# EAGLE schematic working (EAGLE 9.6.2)
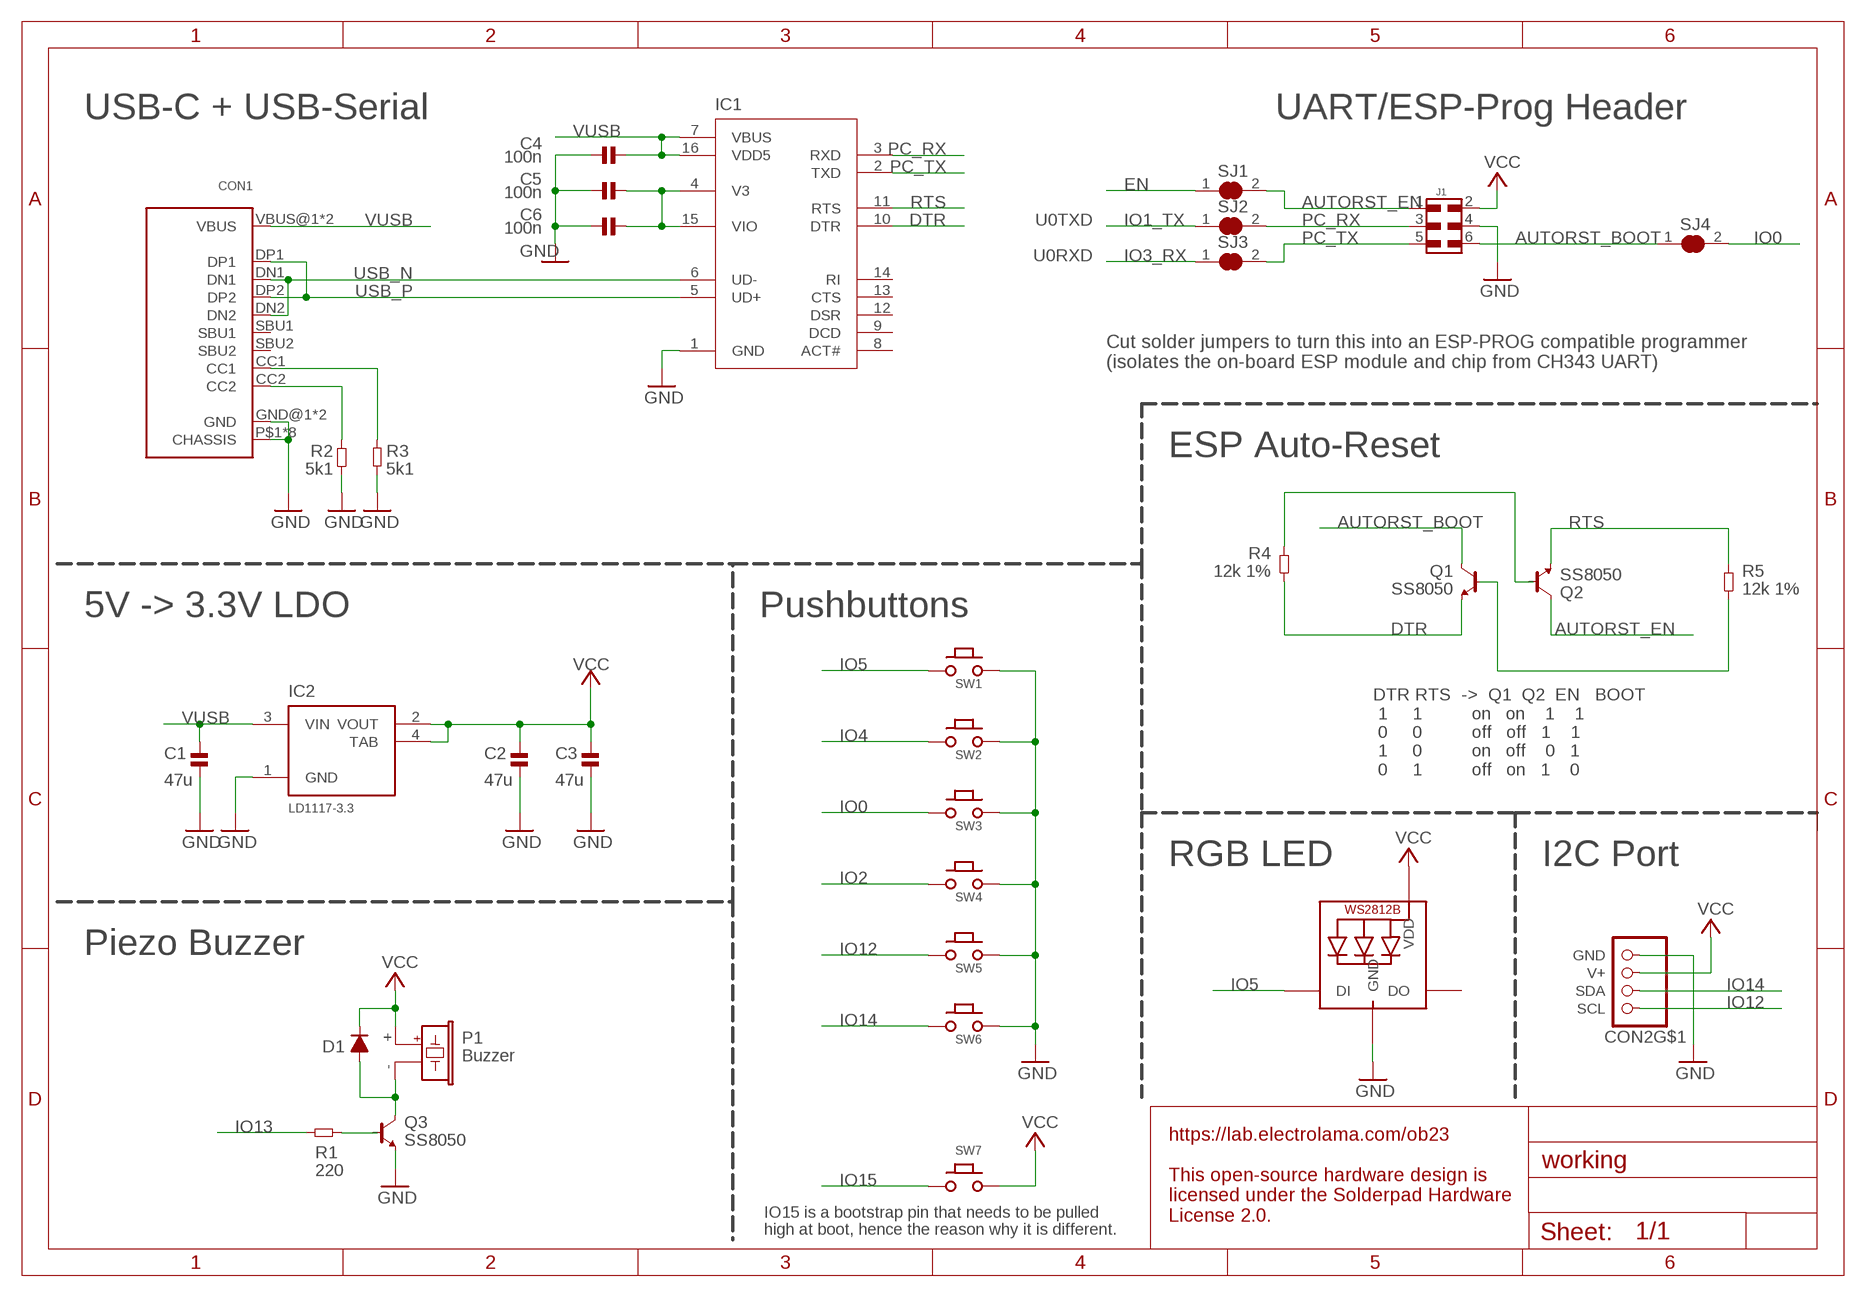
[diagram p0: schematic, sheet 1, part 1 of 2]
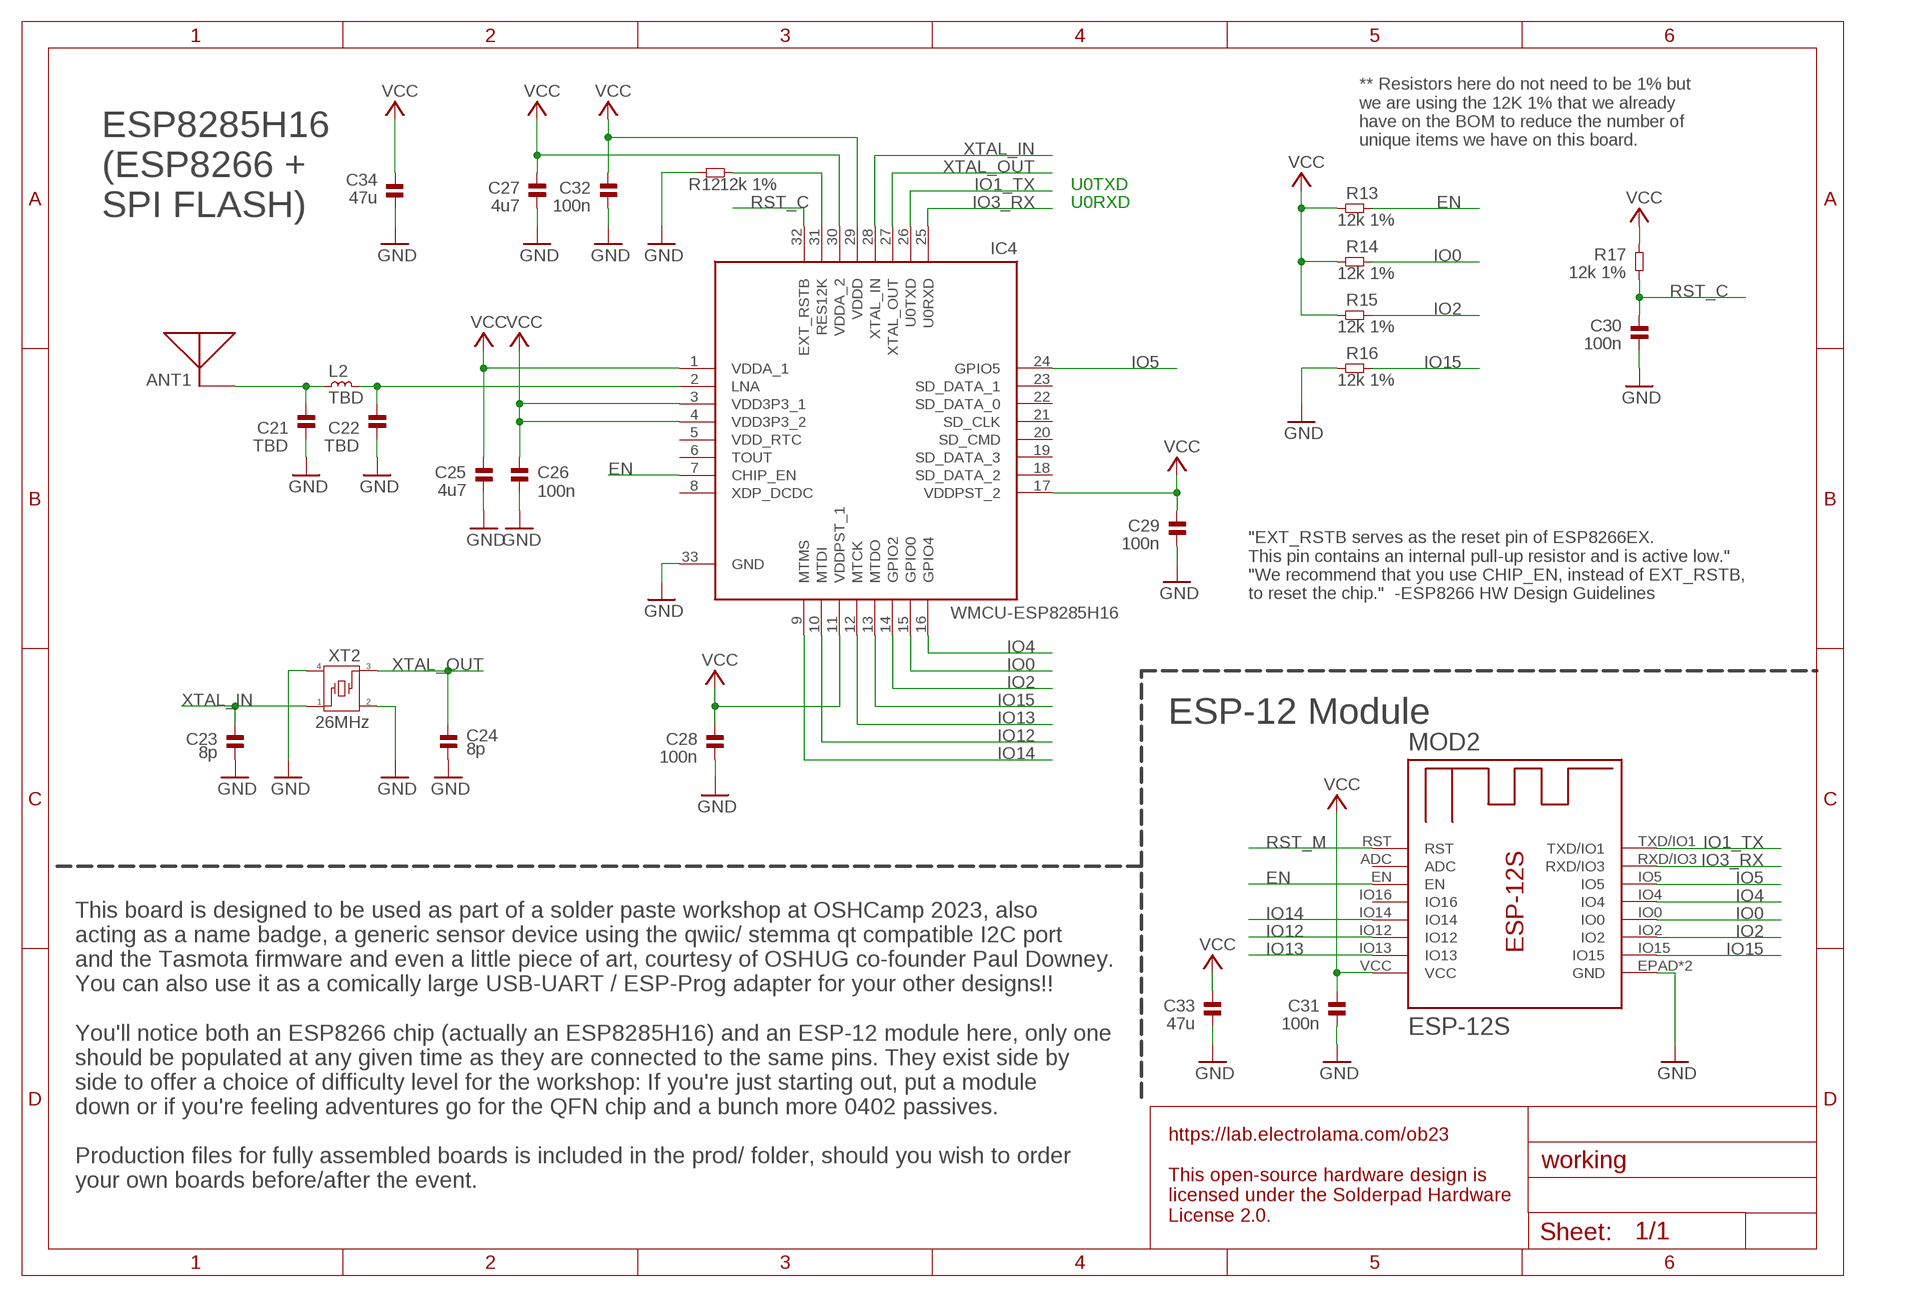
[diagram p1: schematic, sheet 1, part 2 of 2]

## Parts
ANT2  ANT3216LL00R2400A  ANT-CERAMIC-YAGEO-ANT3216LL00R2400A  [YAGEO-ANT3216LL00R2400A]
C1  47u  CAP-1206  [_PKG_C_1206]
C2  47u  CAP-1206  [_PKG_C_1206]
C3  47u  CAP-1206  [_PKG_C_1206]
C4  100n  CAP-0402  [_PKG_C_0402]
C5  100n  CAP-0402  [_PKG_C_0402]
C6  100n  CAP-0402  [_PKG_C_0402]
C21  TBD  CAP-0402-NOTHERMALS  [_PKG_C_0402_NOTHERMALS]
C22  TBD  CAP-0402-NOTHERMALS  [_PKG_C_0402_NOTHERMALS]
C23  8p  CAP-0402  [_PKG_C_0402]
C24  8p  CAP-0402  [_PKG_C_0402]
C25  4u7  CAP-0402-NOTHERMALS  [_PKG_C_0402_NOTHERMALS]
C26  100n  CAP-0402-NOTHERMALS  [_PKG_C_0402_NOTHERMALS]
C27  4u7  CAP-0402-NOTHERMALS  [_PKG_C_0402_NOTHERMALS]
C28  100n  CAP-0402-NOTHERMALS  [_PKG_C_0402_NOTHERMALS]
C29  100n  CAP-0402-NOTHERMALS  [_PKG_C_0402_NOTHERMALS]
C30  100n  CAP-0402-NOTHERMALS  [_PKG_C_0402_NOTHERMALS]
C31  100n  CAP-0402  [_PKG_C_0402]
C32  100n  CAP-0402-NOTHERMALS  [_PKG_C_0402_NOTHERMALS]
C33  47u  CAP-1206  [_PKG_C_1206]
C34  47u  CAP-1206  [_PKG_C_1206]
CON1  USBC_USB-C-12  [USBC_C-31-M-12]
CON2  STEMMA_I2C_QT  [JST_SH4]
D1  DIODE-SWITCHING-1N4148W  [_PKG_SOD123]
IC1  INTERFACE-CH343G  [_PKG_SOP16]
IC2  LD1117-3.3  POWER-LDO-LD1117-SOT223-4  [_PKG_SOT223-4_TI-DCY4]
IC4  WMCU-ESP8285H16  [QFN50P500X500X90-33N]
J1  61030621121  6103XX21121_61030621121  [61030621121]
L2  TBD  INDUCTOR-0402  [_PKG_L_0402]
LED1  WS2812B5050  [WS2812B]
MOD2  ESP-12S  MODULE_ESP-12S  [ESP-12S]
P1  Buzzer  PIEZO-MLT-8530  [MLT-8530]
Q1  SS8050  NPN-MMBT5550LT1G  [SOT96P237X111-3N]
Q2  SS8050  NPN-MMBT5550LT1G  [SOT96P237X111-3N]
Q3  SS8050  NPN-MMBT5550LT1G  [SOT96P237X111-3N]
R1  220  RES-0603  [_PKG_R_0603]
R2  5k1  RES-0603  [_PKG_R_0603]
R3  5k1  RES-0603  [_PKG_R_0603]
R4  12k 1%  RES-0402  [_PKG_R_0402]
R5  12k 1%  RES-0402  [_PKG_R_0402]
R12  12k 1%  RES-0402  [_PKG_R_0402]
R13  12k 1%  RES-0402  [_PKG_R_0402]
R14  12k 1%  RES-0402  [_PKG_R_0402]
R15  12k 1%  RES-0402  [_PKG_R_0402]
R16  12k 1%  RES-0402  [_PKG_R_0402]
R17  12k 1%  RES-0402  [_PKG_R_0402]
SJ1  SJ-SHORT  [SJ-SHORT]
SJ2  SJ-SHORT  [SJ-SHORT]
SJ3  SJ-SHORT  [SJ-SHORT]
SJ4  SJ-SHORT  [SJ-SHORT]
SW1  PUSHBUTTON-6X6MM  [GENERIC_SPNO_4P_6X6MM]
SW2  PUSHBUTTON-6X6MM  [GENERIC_SPNO_4P_6X6MM]
SW3  PUSHBUTTON-6X6MM  [GENERIC_SPNO_4P_6X6MM]
SW4  PUSHBUTTON-6X6MM  [GENERIC_SPNO_4P_6X6MM]
SW5  PUSHBUTTON-6X6MM  [GENERIC_SPNO_4P_6X6MM]
SW6  PUSHBUTTON-6X6MM  [GENERIC_SPNO_4P_6X6MM]
SW7  PUSHBUTTON-6X6MM  [GENERIC_SPNO_4P_6X6MM]
XT2  26MHz  XTAL-4P-2016  [XTAL-4P-2016]

## Nets
ANT1: C22.2 IC4.2(LNA) L2.2
ANT'1: ANT2.S1(FEED) C21.2 L2.1
AUTORST_BOOT: J1.6 Q1.3(C) SJ4.1
AUTORST_EN: J1.1 Q2.3(C) SJ1.2
CH343_3V: C5.1 C6.1 IC1.4(V3) IC1.15(VIO)
DTR: IC1.10(DTR) Q1.2(E) R4.1
EN: IC4.7(CHIP_EN) MOD2.EN R13.2 SJ1.1
GND: C1.2 C2.2 C3.2 C4.2 C5.2 C6.2 C21.1 C22.1 C23.1 C24.1 C25.1 C26.1 C27.1 C28.1 C29.1 C30.1 C31.2 C32.1 C33.2 C34.2 CON1.GND@1(GND) CON1.GND@2(GND) CON1.P$1(CHASSIS) CON1.P$2(CHASSIS) CON1.P$3(CHASSIS) CON1.P$4(CHASSIS) CON1.P$5(CHASSIS) CON1.P$6(CHASSIS) CON1.P$7(CHASSIS) CON1.P$8(CHASSIS) CON2.1(GND) IC1.1(GND) IC2.1(GND) IC4.33(GND) J1.4 LED1.3-GND(GND) MOD2.EPAD(GND) MOD2.GND Q3.2(E) R2.1 R3.1 R12.2 R16.1 SW1.P$3 SW1.P$4 SW2.P$3 SW2.P$4 SW3.P$3 SW3.P$4 SW4.P$3 SW4.P$4 SW5.P$3 SW5.P$4 SW6.P$3 SW6.P$4 XT2.2 XT2.4
IO0: IC4.15(GPIO0) MOD2.IO0 R14.2 SJ4.2 SW3.P$1 SW3.P$2
IO1_TX: IC4.26(U0TXD) MOD2.TXD/IO1 SJ2.1
IO2: IC4.14(GPIO2) MOD2.IO2 R15.2 SW4.P$1 SW4.P$2
IO3_RX: IC4.25(U0RXD) MOD2.RXD/IO3 SJ3.1
IO4: IC4.16(GPIO4) MOD2.IO4 SW2.P$1 SW2.P$2
IO5: IC4.24(GPIO5) LED1.4-DIN(DI) MOD2.IO5 SW1.P$1 SW1.P$2
IO12: CON2.4(SCL) IC4.10(MTDI) MOD2.IO12 SW5.P$1 SW5.P$2
IO13: IC4.12(MTCK) MOD2.IO13 R1.2
IO14: CON2.3(SDA) IC4.9(MTMS) MOD2.IO14 SW6.P$1 SW6.P$2
IO15: IC4.13(MTDO) MOD2.IO15 R16.2 SW7.P$1 SW7.P$2
N$1: IC4.31(RES12K) R12.1
N$5: Q1.1(B) R5.1
N$12: D1.2(A) P1.- Q3.3(C)
N$13: Q2.1(B) R4.2
N$16: CON1.CC1 R3.2
N$17: CON1.CC2 R2.2
N$23: Q3.1(B) R1.1
PC_RX: IC1.3(RXD) J1.3 SJ2.2
PC_TX: IC1.2(TXD) J1.5 SJ3.2
RST_C: C30.2 IC4.32(EXT_RSTB) R17.1
RST_M: MOD2.RST
RTS: IC1.11(RTS) Q2.2(E) R5.2
USB_N: CON1.DN1 CON1.DN2 IC1.6(UD-)
USB_P: CON1.DP1 CON1.DP2 IC1.5(UD+)
VCC: C2.1 C3.1 C25.2 C26.2 C27.2 C28.2 C29.2 C31.1 C32.2 C33.1 C34.1 CON2.2(V+) D1.1(C) IC2.2(VOUT) IC2.4(TAB) IC4.1(VDDA_1) IC4.3(VDD3P3_1) IC4.4(VDD3P3_2) IC4.11(VDDPST_1) IC4.17(VDDPST_2) IC4.29(VDDD) IC4.30(VDDA_2) J1.2 LED1.1-VDD(VDD) MOD2.VCC P1.+ R13.1 R14.1 R15.1 R17.2 SW7.P$3 SW7.P$4
VUSB: C1.1 C4.1 CON1.VBUS@1(VBUS) CON1.VBUS@2(VBUS) IC1.7(VBUS) IC1.16(VDD5) IC2.3(VIN)
XTAL_IN: C23.2 IC4.28(XTAL_IN) XT2.1
XTAL_OUT: C24.2 IC4.27(XTAL_OUT) XT2.3
Unconnected: CON1.SBU1 CON1.SBU2 CON2.MT1(MT) CON2.MT2(MT) IC1.8(ACT#) IC1.9(DCD) IC1.12(DSR) IC1.13(CTS) IC1.14(RI) IC4.5(VDD_RTC) IC4.6(TOUT) IC4.8(XDP_DCDC) IC4.18(SD_DATA_2) IC4.19(SD_DATA_3) IC4.20(SD_CMD) IC4.21(SD_CLK) IC4.22(SD_DATA_0) IC4.23(SD_DATA_1) LED1.2-DOUT(DO) MOD2.ADC MOD2.IO16

## Notes on the sheet
- USB-C + USB-Serial | UART/ESP-Prog Header
- ESP8285H16
  (ESP8266 +
  SPI FLASH)
- ** Resistors here do not need to be 1% but
  we are using the 12K 1% that we already
  have on the BOM to reduce the number of
  unique items we have on this board.
- U0TXD
- U0RXD
- U0TXD
- U0RXD
- Cut solder jumpers to turn this into an ESP-PROG compatible programmer
  (isolates the on-board ESP module and chip from CH343 UART)
- ANT1
- ESP Auto-Reset
- 5V -> 3.3V LDO | Pushbuttons
- "EXT_RSTB serves as the reset pin of ESP8266EX. 
  This pin contains an internal pull-up resistor and is active low."
  "We recommend that you use CHIP_EN, instead of EXT_RSTB, 
  to reset the chip."  -ESP8266 HW Design Guidelines
- DTR RTS  ->  Q1  Q2  EN   BOOT
   1     1          on   on    1    1
   0     0          off   off   1    1
   1     0          on   off    0   1
   0     1          off   on   1    0
- ESP-12 Module
- RGB LED | I2C Port
- This board is designed to be used as part of a solder paste workshop at OSHCamp 2023, also
  acting as a name badge, a generic sensor device using the qwiic/ stemma qt compatible I2C port 
  and the Tasmota firmware and even a little piece of art, courtesy of OSHUG co-founder Paul Downey. 
  You can also use it as a comically large USB-UART / ESP-Prog adapter for your other designs!!
  
  You'll notice both an ESP8266 chip (actually an ESP8285H16) and an ESP-12 module here, only one 
  should be populated at any given time as they are connected to the same pins. They exist side by 
  side to offer a choice of difficulty level for the workshop: If you're just starting out, put a module 
  down or if you're feeling adventures go for the QFN chip and a bunch more 0402 passives.
  
  Production files for fully assembled boards is included in the prod/ folder, should you wish to order 
  your own boards before/after the event.
- Piezo Buzzer
- https://lab.electrolama.com/ob23
  
  This open-source hardware design is 
  licensed under the Solderpad Hardware 
  License 2.0.
- https://lab.electrolama.com/ob23
  
  This open-source hardware design is 
  licensed under the Solderpad Hardware 
  License 2.0.
- IO15 is a bootstrap pin that needs to be pulled
  high at boot, hence the reason why it is different.

## Library data of the parts
ANT2 = ok-rf-dev:ANT-CERAMIC-YAGEO-ANT3216LL00R2400A; JLCASSY: C293767
C1-C3 C33 C34 = ok-discretes-dev:CAP; JLCASSY: C96123; MPN: CL31A476MPHNNNE
C4-C6 C26 C28-C32 = ok-discretes-dev:CAP; JLCASSY: C307331
C21 C22 = ok-discretes-dev:CAP
C23 C24 = ok-discretes-dev:CAP; JLCASSY: C1578
C25 C27 = ok-discretes-dev:CAP; JLCASSY: C23733
CON1 = ok-connectors-dev:USBC_USB-C-12; JLCASSY: C165948
CON2 = microbuilder:STEMMA_I2C; JLCASSY: C145956
D1 = ok-discretes-dev:DIODE-SWITCHING-1N4148W; JLCASSY: C81598
IC1 = ok-chips-dev:INTERFACE-CH343G; JLCASSY: C2844153
IC2 = ok-chips-dev:POWER-LDO-LD1117; JLCASSY: C6186
IC4 = ok-chips-dev:WMCU-ESP8285H16: IC RF TXRX+MCU WIFI 32VFQFN Source: Datasheet <https://componentsearchengine.com/Datasheets/1/ESP8285H16.pdf>; DESCRIPTION: IC RF TXRX+MCU WIFI 32VFQFN; HEIGHT: 0.9mm; JLCASSY: C967019; MANUFACTURER_NAME: Espressif Systems; MANUFACTURER_PART_NUMBER: ESP8285H16; MOUSER_PART_NUMBER: 356-ESP8285H16; MOUSER_PRICE-STOCK: https://www.mouser.co.uk/ProductDetail/Espressif-Systems/ESP8285H16?qs=Cb2nCFKsA8p%2FOZGxIdZOag%3D%3D
J1 = Wurth_Connectors_WR-PHD:6103XX21121_61030621121: WR-PHD 2.54 mm SMT Dual Pin Header ARTICLE PROPERTIES: Pins:4;​ 6;​ 8;​ 10;​ 12;​ 14;​ 16;​ 20 KIND PROPERTIES: Pitch：2.54 mm Quality Class:3 as per CECC 75 301-802 Rows：Dual Gender：Pin Header Type：Straight MATERIAL PROPERTIES: Insulator Material :PA6T Insulator Flammability Rating:UL94 V-0 Contact Material:Copper Alloy Contact Plating:Gold Contact Type:Stamped GENERAL INFORMATION Operating Temperature:-40 up to +125 °C ELECTRICAL PROPERTIES: Rated Current:max. IR 1:3 A Withstanding Voltage:500 V (AC) Contact Resistance:20 mΩ RISO:1000 MΩ CERTIFICATION UL Approval:E323964 PACKAGING PROPERTIES Packaging:Tape and Reel with Cap <https://www.we-online.com/catalog/media/o33205v209%20Family_WR-PHD_610xxx21121.jpg> Details see: https://www.we-online.com/catalog/en/PHD_2_54_SMT_DUAL_PIN_HEADER_6100XX21121 Updated by Ella Wu 2021-11-04 2021 (C) Würth Elektronik; DATASHEET-URL: https://www.we-online.com/redexpert/spec/61030621121?ae; GENDER: Pin Header; IR: 3A; JLCASSY: C780054; MOUNT: THT; PACKAGING: Tape and Reel with Cap; PART-NUMBER: 61030621121; PINS: 6; PITCH: 2.54mm; ROWS: Dual; TYPE: Straight
L2 = ok-discretes-dev:INDUCTOR
LED1 = adafruit:WS2812B
MOD2 = ok-modules-dev:MODULE_ESP-12S; JLCASSY: C82898
P1 = ok-electromech-dev:PIEZO-MLT-8530; JLCASSY: C94599
Q1-Q3 = ok-discretes-dev:NPN-MMBT5550LT1G: Source: Datasheet <http://www.onsemi.com/pub/Collateral/MMBT5550LT1-D.PDF>; ARROW_PART_NUMBER: MMBT5550LT1G; ARROW_PRICE-STOCK: https://www.arrow.com/en/products/mmbt5550lt1g/on-semiconductor?region=nac; HEIGHT: 1.11mm; JLCASSY: C2150; MANUFACTURER_NAME: ON Semiconductor; MANUFACTURER_PART_NUMBER: MMBT5550LT1G; MOUSER_PART_NUMBER: 863-MMBT5550LT1G; MOUSER_PRICE-STOCK: https://www.mouser.co.uk/ProductDetail/onsemi/MMBT5550LT1G?qs=R2UZ7gjkEjKW3fmkaqXxTw%3D%3D
R1 = ok-discretes-dev:RES; JLCASSY: C22962
R2 R3 = ok-discretes-dev:RES; JLCASSY: C23186
R4 R5 R12-R17 = ok-discretes-dev:RES; JLCASSY: C25752
SJ1-SJ4 = ok-mechanical-dev:SJ-SHORT
SW1-SW7 = ok-electromech-dev:PUSHBUTTON-6X6MM; JLCASSY: C620316
XT2 = ok-xtal-osc-dev:XTAL-4P-2016; JLCASSY: C2762193